# EAGLE design sensor-board (EAGLE 9.6.2)
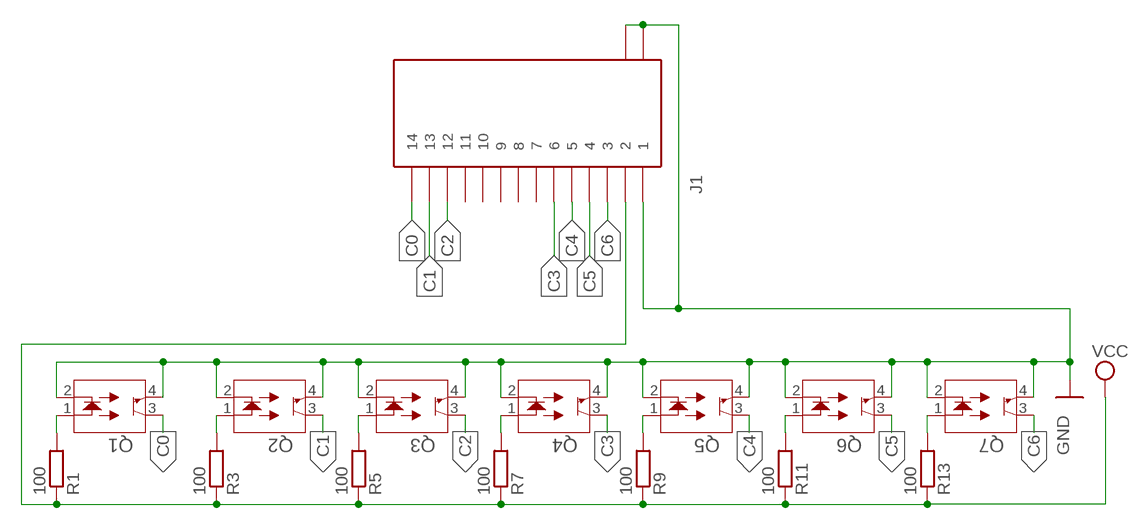
[diagram p0: schematic, sheet 1]

## Parts
J1  686114148922  [686114148922]
Q1  QRE1113  [DIP4_100AQ_ONS]
Q2  QRE1113  [DIP4_100AQ_ONS]
Q3  QRE1113  [DIP4_100AQ_ONS]
Q4  QRE1113  [DIP4_100AQ_ONS]
Q5  QRE1113  [DIP4_100AQ_ONS]
Q6  QRE1113  [DIP4_100AQ_ONS]
Q7  QRE1113  [DIP4_100AQ_ONS]
R1  100  R-EU_0207/10  [0207/10]
R3  100  R-EU_0207/10  [0207/10]
R5  100  R-EU_0207/10  [0207/10]
R7  100  R-EU_0207/10  [0207/10]
R9  100  R-EU_0207/10  [0207/10]
R11  100  R-EU_0207/10  [0207/10]
R13  100  R-EU_0207/10  [0207/10]

## Nets
C0: J1.14 Q1.3
C1: J1.13 Q2.3
C2: J1.12 Q3.3
C3: J1.6 Q4.3
C4: J1.5 Q5.3
C5: J1.4 Q6.3
C6: J1.3 Q7.3
GND: J1.1 J1.MP1 J1.MP2 Q1.2 Q1.4 Q2.2 Q2.4 Q3.2 Q3.4 Q4.2 Q4.4 Q5.2 Q5.4 Q6.2 Q6.4 Q7.2 Q7.4
N$1: Q1.1 R1.2
N$3: Q2.1 R3.2
N$4: Q5.1 R9.2
N$5: Q3.1 R5.2
N$7: Q4.1 R7.2
N$11: Q6.1 R11.2
N$13: Q7.1 R13.2
VCC: J1.2 R1.1 R3.1 R5.1 R7.1 R9.1 R11.1 R13.1
Unconnected: J1.7 J1.8 J1.9 J1.10 J1.11

## Library data of the parts
J1 = 686114148922:686114148922: Wurth Elektronik WR-FPC 1mm Pitch 14 Way Horizontal SMT Female FPC Connector, ZIF Bottom Contact Source: Datasheet <https://www.we-online.com/catalog/datasheet/686114148922.pdf>; DESCRIPTION: Wurth Elektronik WR-FPC 1mm Pitch 14 Way Horizontal SMT Female FPC Connector, ZIF Bottom Contact; HEIGHT: 2.3mm; MANUFACTURER_NAME: Wurth Elektronik; MANUFACTURER_PART_NUMBER: 686114148922; MOUSER_PART_NUMBER: 710-686114148922; MOUSER_PRICE-STOCK: https://www.mouser.co.uk/ProductDetail/Wurth-Elektronik/686114148922?qs=a9WhcLg8qCz0mPj5zZqo5g%3D%3D
Q1-Q7 = qre1113:QRE1113; COPYRIGHT: Copyright (C) 2024 Ultra Librarian. All rights reserved.; MANUFACTURER_PART_NUMBER: QRE1113; MFR_NAME: onsemi
R1 R3 R5 R7 R9 R11 R13 = rcl:R-EU_: RESISTOR, European symbol; SPICEPREFIX: R

## Board
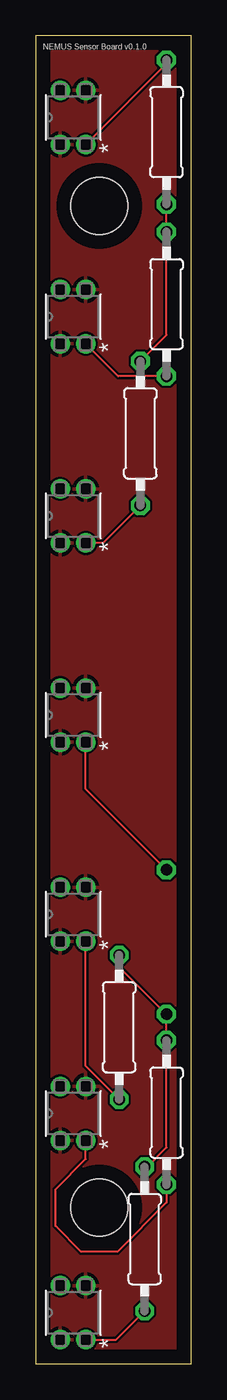
[diagram p1: board, top side]
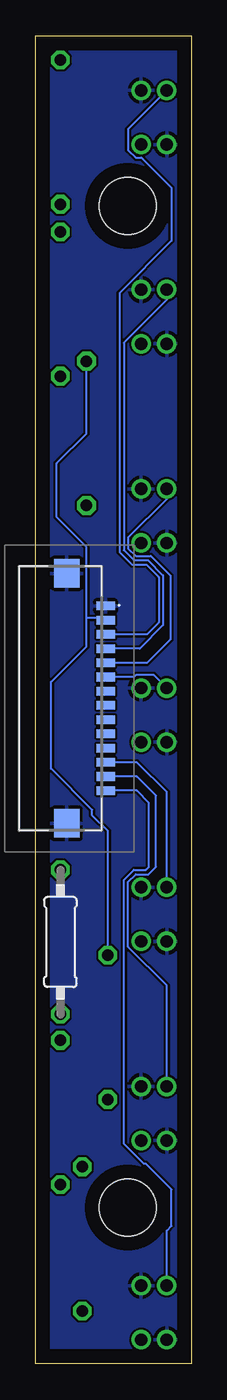
[diagram p2: board, bottom side, seen from below]

Size 11 x 93.5 mm. Coordinates in mm from the lower left corner, seen from the top.
Outline: 0,0 11,0 11,93.5 0,93.5 0,0
Copper layers (1*16): Top 0.035mm / dielectric 1.5mm / Bottom 0.035mm
Design rules "default": minimum track width 6mil, minimum drill 0.35mm, track to track 6mil, track to pad 6mil, pad to pad 6mil, via to via 6mil, smd to smd 6mil, copper to edge 40mil, drill to drill 6mil, minimum pad ring 10mil, minimum via ring 8mil, stop-mask expansion 4mil, vias tented up to drill 0mil, thermal gap 10mil
Holes 4 mm at 4.5,81.5 4.5,11

### Footprints (pad centres in the part's own frame; a part is rotated, then mirrored left to right if it is on the bottom)
686114148922 = smd 0.6 x 1.3: 1 -6.5,3.05; 2 -5.5,3.05; 3 -4.5,3.05; 4 -3.5,3.05; 5 -2.5,3.05; 6 -1.5,3.05; 7 -0.5,3.05; 8 0.5,3.05; 9 1.5,3.05; 10 2.5,3.05; 11 3.5,3.05; 12 4.5,3.05; 13 5.5,3.05; 14 6.5,3.05 | smd 2 x 1.8: MP1 -8.8,0.3; MP2 8.8,0.3
DIP4_100AQ_ONS = drill 0.864 pad 1.372: 1 0,0; 2 3.81,0; 3 3.81,1.803; 4 0,1.803
0207/10 = drill 0.813 octagon: 1 -5.08,0; 2 5.08,0

### Placement (x,y rotation side)
J1  9.1,46.85 270 bottom
Q1  3.55,1.71 90 top
Q2  3.55,15.72 90 top
Q3  3.55,29.75 90 top
Q4  3.55,43.77 90 top
Q5  3.55,57.78 90 top
Q6  3.55,71.81 90 top
Q7  3.55,85.83 90 top
R1  7.7,8.8 270 top
R3  9.24,17.7 270 top
R5  5.9,23.7 270 top
R7  9.24,29.7 90 bottom
R9  7.4,65.5 270 top
R11  9.24,74.6 270 top
R13  9.24,86.7 90 top

### Tracks (layer width: path | path; a pad name or v marks a point on that pad's centre or on a via)
C0
  Bottom 0.152: J1.14 3.85,40.35 3,39.5 3,35 3.23,34.77 4.05,34.77 4.77,34.06 4.77,15.5 3.36,14.09 3.22,14.09 1.41,12.28 1.41,9.72 1.75,9.38 Q1.3
C1
  Bottom 0.152: Q2.3 1.75,26.65 4.46,29.37 4.46,33.93 3.93,34.47 3.03,34.47 2.5,35 2.5,40 3.85,41.35 J1.13
C2
  Bottom 0.152: Q3.3 1.75,40.25 3.85,42.35 J1.12
C3
  Bottom 0.152: J1.6 4.07,48.35 3.93,48.49 2.66,48.49 Q4.3
C4
  Bottom 0.152: Q5.3 1.75,60.88 4.46,58.16 4.46,57.41 3.93,56.87 2.87,56.87 1.5,55.5 1.5,51 3.15,49.35 J1.5
C5
  Bottom 0.152: Q6.3 1.75,74.9 4.77,71.88 4.77,57.28 4.05,56.57 3.07,56.57 2,55.5 2,52 3.65,50.35 J1.4
C6
  Bottom 0.152: Q7.3 4.46,86.92 4.46,85.45 3.93,84.91 3.54,84.91 1.41,82.78 1.41,79.05 5.07,75.38 5.07,57.15 4.18,56.26 3.19,56.26 2.31,55.37 2.31,52.2 3.15,51.35 J1.3
GND
  pour Top: 0,93.5 11,93.5 11,0 0,0
  pour Bottom: 11,93.5 0,93.5 0,0 11,0
N$1
  Top 0.152: Q1.1 5.68,1.71 R1.2
N$3
  Top 0.152: Q2.1 3.55,14.42 1.41,12.28 1.41,9.72 3.22,7.91 5.78,7.91 9.24,11.37 R3.2
N$4
  Top 0.152: R9.2 4.76,57.78 Q5.1
N$5
  Top 0.152: R5.2 3.55,20.97 Q3.1
N$7
  Top 0.152: R7.2 3.55,40.47 Q4.1
N$11
  Top 0.152: R11.2 5.83,69.52 Q6.1
N$13
  Top 0.152: Q7.1 9.24,91.52 R13.2
VCC
  Top 0.152: R1.1 7.88,13.88 9.24,15.24 R3.1 R7.1 5.9,27.96 R5.1 | R9.1 9.24,72.42 R11.1 R13.1
  Bottom 0.152: R5.1 5.9,37.5 7,38.6 7,39 9.91,41.91 9.91,48 7.4,50.51 7.4,52.5 | 7.4,52.5 7.4,57.5 9.5,59.6 9.5,63.4 7.4,65.5 R9.1 | J1.2 6.2,52.5 7.4,52.5

### Text on the board
tNames: NEMUS Sensor Board v0.1.0